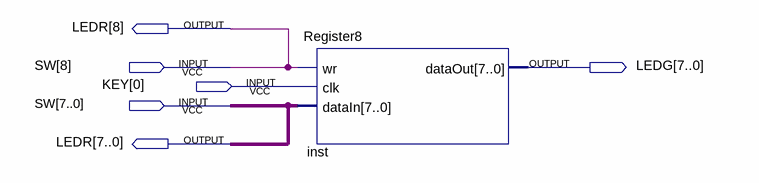
[diagram p0: schematic sheet]
// Quartus schematic Register_Demo.bdf as structural Verilog: 1 symbols, 6 pins
module Register_Demo (
  input  [8:0] SW,
  input  [0:0] KEY,
  output [8:0] LEDR,
  output [7:0] LEDG
);

  Register8 inst (.wr(SW[8]), .clk(KEY[0]), .dataIn(SW[7:0]), .dataOut(LEDG));

  assign LEDR = SW;
endmodule
